# Altium schematic sheet FP_connectors.SchDoc: =ProjectName
size 420 x 297 mm; Author: SBH; CompanyName: WUT; DrawnBy: SBH; Organization: ISE-WUT; Address1: Warsaw Univeristy of Technology; Address2: Nowowiejska 15/19; DocumentNumber: 2; Revision: -; SheetNumber: 2; SheetTotal: 12; EDA_Number: ARTIQ; Projet: eRTM15 Baikal; ModifiedBy: -; CreateDate: XX/XX/XXXX; CheckedDate: -; Title2: FP_connectors.SchDoc; DivGrp: ISE; Designer: SBH; ModifiedDate: -; ProjectName: eRTM15 Baikal
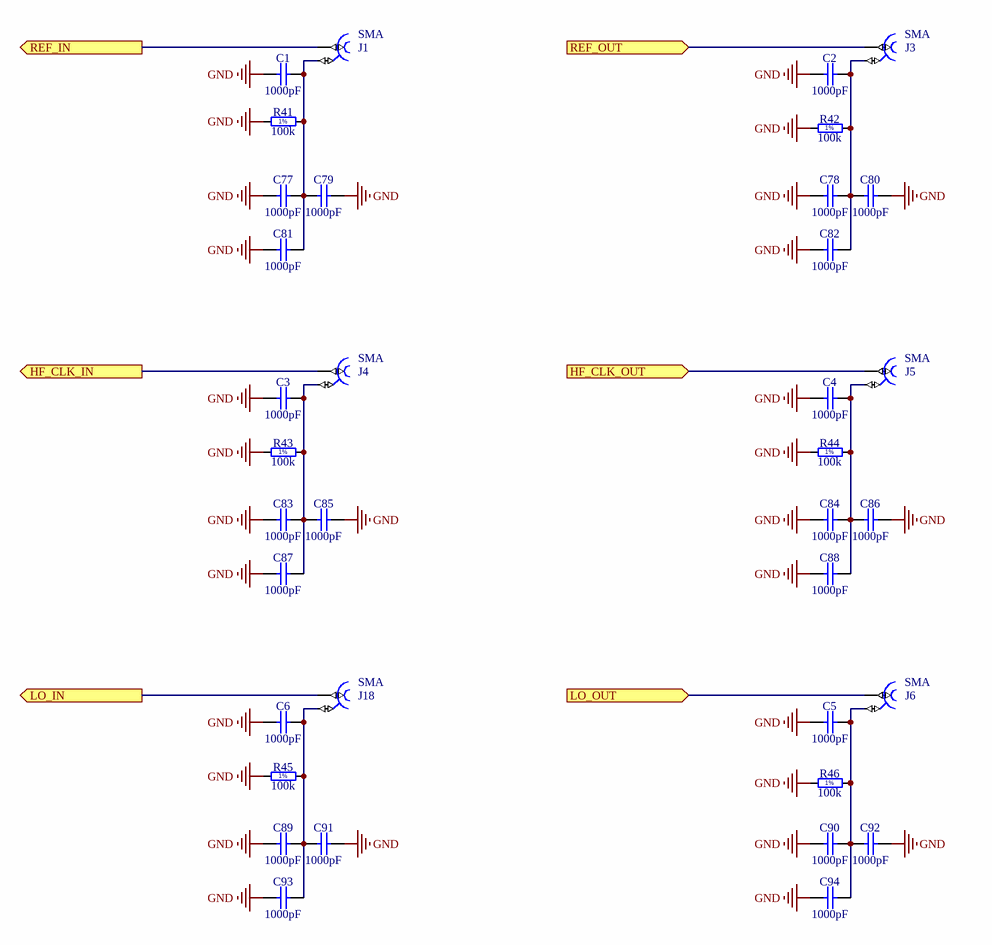
[diagram p0: FP_connectors.SchDoc]

## Parts
C1  1000pF  [CAPC1005X55N]
C2  1000pF  [CAPC1005X55N]
C3  1000pF  [CAPC1005X55N]
C4  1000pF  [CAPC1005X55N]
C5  1000pF  [CAPC1005X55N]
C6  1000pF  [CAPC1005X55N]
C77  1000pF  [CAPC1005X55N]
C78  1000pF  [CAPC1005X55N]
C79  1000pF  [CAPC1005X55N]
C80  1000pF  [CAPC1005X55N]
C81  1000pF  [CAPC1005X55N]
C82  1000pF  [CAPC1005X55N]
C83  1000pF  [CAPC1005X55N]
C84  1000pF  [CAPC1005X55N]
C85  1000pF  [CAPC1005X55N]
C86  1000pF  [CAPC1005X55N]
C87  1000pF  [CAPC1005X55N]
C88  1000pF  [CAPC1005X55N]
C89  1000pF  [CAPC1005X55N]
C90  1000pF  [CAPC1005X55N]
C91  1000pF  [CAPC1005X55N]
C92  1000pF  [CAPC1005X55N]
C93  1000pF  [CAPC1005X55N]
C94  1000pF  [CAPC1005X55N]
J1  SMA  [TELEGARTNER_J01151A0451]
J3  SMA  [TELEGARTNER_J01151A0451]
J4  SMA  [TELEGARTNER_J01151A0451]
J5  SMA  [TELEGARTNER_J01151A0451]
J6  SMA  [TELEGARTNER_J01151A0451]
J18  SMA  [TELEGARTNER_J01151A0451]
R41  100k  [RESC1005X40N]
R42  100k  [RESC1005X40N]
R43  100k  [RESC1005X40N]
R44  100k  [RESC1005X40N]
R45  100k  [RESC1005X40N]
R46  100k  [RESC1005X40N]

## Ports
HF_CLK_IN (out), HF_CLK_OUT (in), LO_IN (out), LO_OUT (in), REF_IN (out), REF_OUT (in)

## Nets
GND: C1.1 C2.1 C3.1 C4.1 C5.1 C6.1 C77.1 C78.1 C79.2 C80.2 C81.1 C82.1 C83.1 C84.1 C85.2 C86.2 C87.1 C88.1 C89.1 C90.1 C91.2 C92.2 C93.1 C94.1 R41.1 R42.1 R43.1 R44.1 R45.1 R46.1
HF_CLK_IN: J4.1 ; port HF_CLK_IN
HF_CLK_OUT: J5.1 ; port HF_CLK_OUT
LO_IN: J18.1 ; port LO_IN
LO_OUT: J6.1 ; port LO_OUT
REF_IN: J1.1 ; port REF_IN
REF_OUT: J3.1 ; port REF_OUT
NetC1_2: C1.2 C77.2 C79.1 C81.2 J1.2 R41.2
NetC2_2: C2.2 C78.2 C80.1 C82.2 J3.2 R42.2
NetC3_2: C3.2 C83.2 C85.1 C87.2 J4.2 R43.2
NetC4_2: C4.2 C84.2 C86.1 C88.2 J5.2 R44.2
NetC5_2: C5.2 C90.2 C92.1 C94.2 J6.2 R46.2
NetC6_2: C6.2 C89.2 C91.1 C93.2 J18.2 R45.2

## Notes on the sheet
- Project/Equipment
- Document
- Designer
- Drawn by
- Check.by
- File
- Last Mod.
- Print Date
- Sheet
- Size
- A3
- of
- Rev
- (in symbol R0402_4K7_1%_0.0625W_100PPM) 1%

## Library data of the parts
C1-C6 C77-C94 = CC0402_100PF_50V_5%_C0G: Non-polarised capacitor; Part Number: CC0402_1000PF_50V_5%_C0G; Part Description: SMD Multilayer Chip Ceramic Capacitor; Manufacturer: GENERIC; Manufacturer1 Part Number: C0402C102J5RACTU; Voltage: 50V; TC: C0G/NP0; Tolerance: ±5%; Component Kind: Standard; Component Type: Standard; Pin Count: 2; Value: 1000pF; Status: Preferred; Manufacturer Part Number: CC0402_100PF_50V_5%_C0G; Case: 0402; Mounted: Yes; Socket: No; SMD: Yes; Sense: No; Manufacturer1 Example: KEMET; Manufacturer1 ComponentHeight: 0.55mm; HelpURL: \\cern.ch\dfs\Applications\Altium\Datasheets\CC0805_C0G_KEMET_(Commercial Grade).pdf; Author: CERN DEM JLC; CreateDate: 2007-12-03; LatestRevisionDate: 2015-04-22
J1 J3-J6 J18 = TELEGARTNER_J01151A0451: Part Description: SMA 50 ohms Edge Mount Bulkhead Jack Receptacle; PressFit: No; Part Number: TELEGARTNER_J01151A0451; Component Kind: Standard; Component Type: Standard; Pin Count: 2; Family: SMA; Mounted: Yes; Socket: No; SMD: No; Sense: No; Status: None; Manufacturer: TELEGARTNER; Manufacturer Part Number: J01151A0451; ComponentHeight: 7mm; HelpURL: \\cern.ch\dfs\Applications\Altium\Datasheets\TELEGARTNER_J01151A0451.pdf; Author: CERN DEM JLC; CreateDate: 27.10.2016; LatestRevisionDate: 27.10.2016
R41-R46 = R0402_4K7_1%_0.0625W_100PPM: Resistor - 1%; Part Number: R0402_100k_1%_0.0625W_100PPM; Part Description: General Purpose Thick Film Chip Resistor; Manufacturer: GENERIC; Manufacturer1 Part Number: RC0402FR-07100KL; TC: ±100ppm/°C; Component Kind: Standard; Component Type: Standard; Pin Count: 2; Value: 100k; Status: Not recommended; Power: 0.0625W; Tolerance: ±1%; Manufacturer Part Number: R0402_4K7_1%_0.0625W_100PPM; Case: 0402; Mounted: Yes; Sense: No; Socket: No; SMD: Yes; Manufacturer1 Example: YAGEO PHYCOMP; Manufacturer1 ComponentHeight: 0.4mm; HelpURL: \\cern.ch\dfs\Applications\Altium\Datasheets\R0402_Phycomp_RC0402.pdf; Author: CERN DEM JLC; CreateDate: 2007-12-03; LatestRevisionDate: 2012-10-17